# EAGLE design vusbtinyisp_smt (EAGLE 6.5.0)
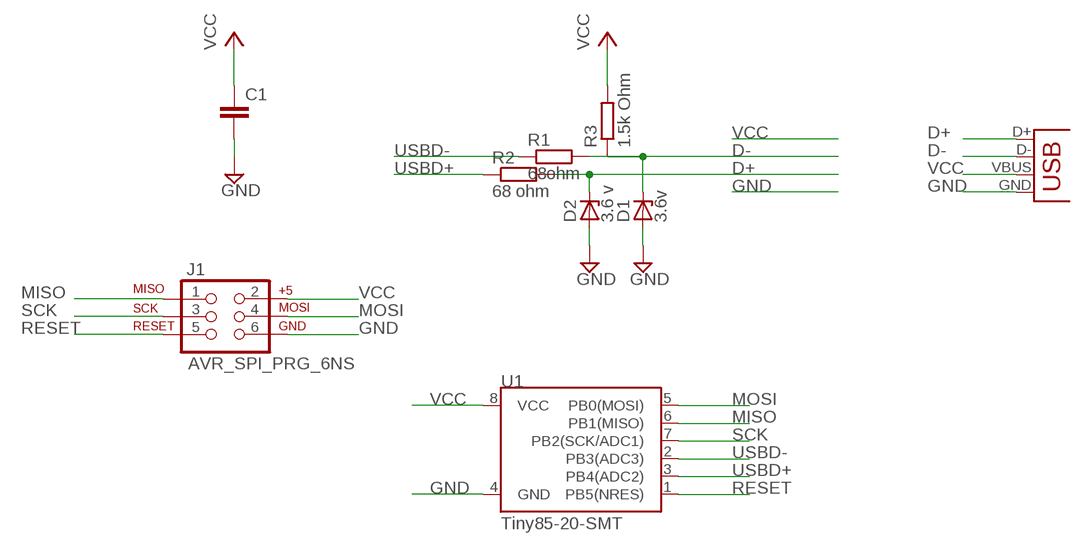
[diagram p0: schematic, sheet 1]

## Parts
C1  CAP1206  [1206]
D1  3.6v  ZENER-DIODESOT23  [SOT23]
D2  3.6 v  ZENER-DIODESOT23  [SOT23]
J1  AVR_SPI_PRG_6NS  [2X3-NS]
JP2  USBSMD  [USB-MINIB]
R1  68ohm  R-EU_R0805  [R0805]
R2  68 ohm  R-EU_R0805  [R0805]
R3  1.5k Ohm  R-EU_R1206  [R1206]
U1  Tiny85-20-SMT  ATTINY45TINY85-20-SMT  [SO08-EIAJ]

## Nets
D+: D2.3(C) JP2.D+ R2.2
D-: D1.3(C) JP2.D- R1.2 R3.1
GND: C1.2 D1.1(A) D2.1(A) J1.6 JP2.GND U1.4(GND)
MISO: J1.1 U1.6(PB1(MISO))
MOSI: J1.4 U1.5(PB0(MOSI))
RESET: J1.5 U1.1(PB5(NRES))
SCK: J1.3 U1.7(PB2(SCK/ADC1))
USBD+: R2.1 U1.3(PB4(ADC2))
USBD-: R1.1 U1.2(PB3(ADC3))
VCC: C1.1 J1.2 JP2.VBUS R3.2 U1.8(VCC)

## Library data of the parts
C1 = SparkFun-Passives:CAP: Capacitor Standard 0603 ceramic capacitor, and 0.1" leaded capacitor.
D1 D2 = diode:ZENER-DIODE: Z-Diode
J1 = SparkFun-Connectors:AVR_SPI_PRG_6: AVR ISP 6 Pin This is the reduced ISP connector for AVR programming. Common on Arduino. This footprint will take up less PCB space and can be used with a 10-pin to 6-pin adapter such as SKU: BOB-08508
JP2 = SparkFun-Connectors:USB: USB Connectors USB-B-PTH is fully proven SKU : PRT-00139/CONN-08278 USB-miniB is fully proven SKU : PRT-00587 USB-A-PCB is untested. USB-A-H is throughly reviewed, but untested. Spark Fun Electronics SKU : PRT-00437 USB-B-SMT is throughly reviewed, but untested. Needs silkscreen touching up. USB-A-S has not been used/tested USB-MB-H has not been used/tested USB-MICROB has been used. CONN-09505; PROD_ID: CONN-08193
R1-R3 = resistor:R-EU_: RESISTOR, European symbol
U1 = SparkFun-DigitalIC:ATTINY45: Atmel 8-pin 2/4/8kB flash uC; PROD_ID: IC-09092

## Net classes
0 default: width 0.203 mm, clearance 0.152 mm

## Board
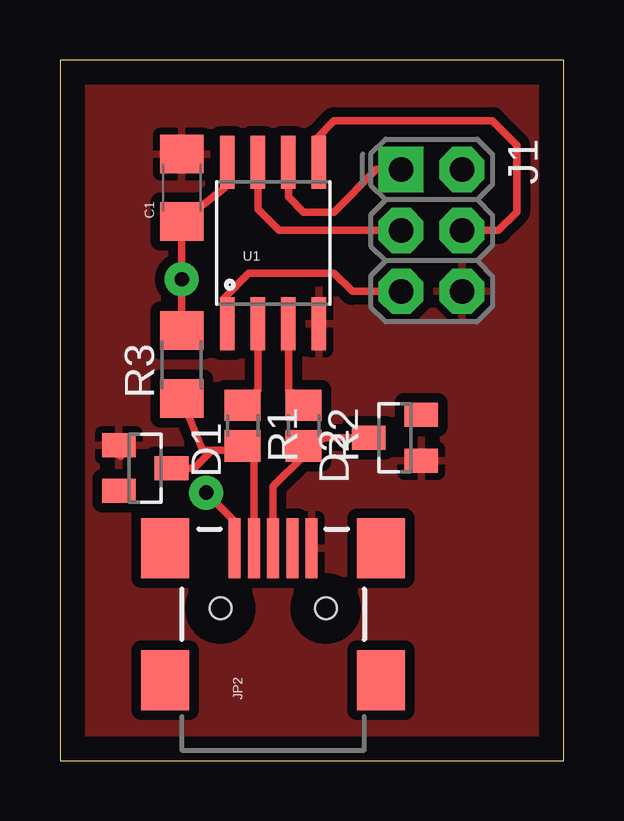
[diagram p1: board, top side]
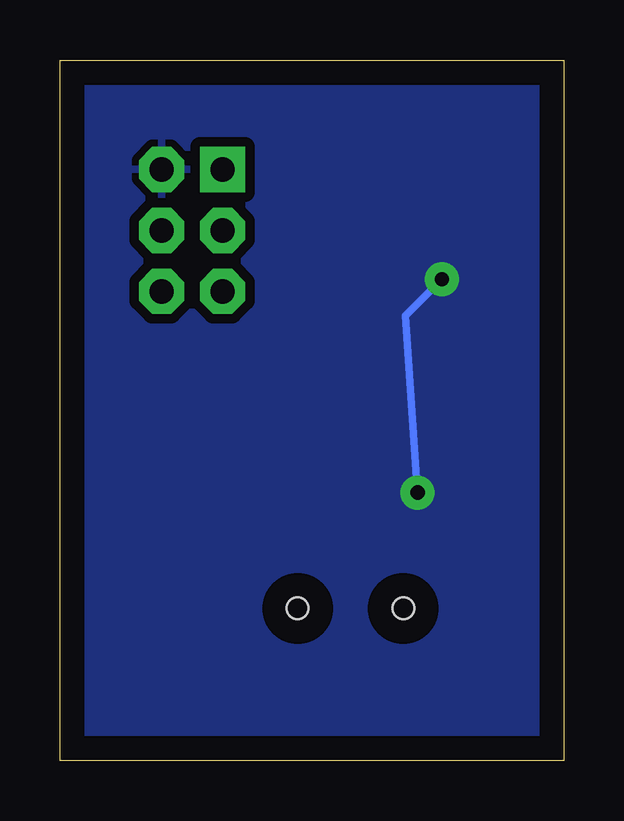
[diagram p2: board, bottom side, seen from below]

Size 21.01 x 29.2 mm. Coordinates in mm from the lower left corner, seen from the top.
Outline: 0,0 21.01,0 21.01,29.2 0,29.2 0,0
Copper layers (1*16): Top 0.035mm / dielectric 1.5mm / Bottom 0.035mm
Design rules "improved_12mil": minimum track width 12mil, minimum drill 0.8mm, track to track 12mil, track to pad 12mil, pad to pad 12mil, via to via 12mil, smd to smd 12mil, copper to edge 40mil, drill to drill 12mil, minimum pad ring 16mil, minimum via ring 16mil, stop-mask expansion 4mil, vias tented up to drill 0mil, thermal gap 12mil

### Footprints (pad centres in the part's own frame; a part is rotated, then mirrored left to right if it is on the bottom)
1206 = smd 1.6 x 1.8: 1 -1.4,0; 2 1.4,0
SOT23 = smd 1 x 1.4: 1 -0.95,-1.1; 2 0.95,-1.1; 3 0,1.1
2X3-NS = drill 1.016 pad 1.88 square: 1 -2.54,-1.27 | drill 1.016 pad 1.88 octagon: 2 -2.54,1.27; 3 0,-1.27; 4 0,1.27; 5 2.54,-1.27; 6 2.54,1.27
USB-MINIB = smd 2.5 x 0.5: D+ 2.5,0; D- 2.5,0.8; GND 2.5,-1.6; ID 2.5,-0.8; VBUS 2.5,1.6 | smd 2.5 x 2: MTN1 -3,4.5; MTN2 2.5,4.5; MTN3 -3,-4.5; MTN4 2.5,-4.5 | hole 0.9: 0,2.2; 0,-2.2
R0805 = smd 1.3 x 1.5: 1 -0.85,0; 2 0.85,0
R1206 = smd 1.6 x 1.803: 1 -1.422,0; 2 1.422,0
SO08-EIAJ = smd 0.61 x 2.21: 1 -1.905,-3.378; 2 -0.635,-3.378; 3 0.635,-3.378; 4 1.905,-3.378; 5 1.905,3.353; 6 0.635,3.353; 7 -0.635,3.353; 8 -1.905,3.353

### Placement (x,y rotation side)
C1  5.08,23.88 90 top
D1  3.56,12.19 270 top
D2  13.97,13.46 90 top
J1  15.49,22.1 270 top
JP2  8.89,6.35 90 top
R1  7.62,13.97 270 top
R2  10.16,13.97 270 top
R3  5.08,16.51 90 top
U1  8.89,21.59 0 top

### Tracks (layer width: path | path; a pad name or v marks a point on that pad's centre or on a via)
D+
  Top 0.305: JP2.D+ 8.89,11.43 10.16,12.7 R2.2 11.09,13.46 D2.3
D-
  Top 0.305: 7.45,12.95 R1.2 8.09,12.65 JP2.D- | 7.45,12.95 7.45,12.87 | 7.45,12.95 6.35,12.95 | 6.35,12.95 5.95,12.95 R3.1 | D1.3 5.59,12.19 6.35,12.95
GND
  Top 0.305: D1.1 2.54,12.7 2.81,13.04
  pour Top (isolate 0.406): -2.54,31.75 -2.54,-2.54 21.59,-2.54 21.59,33.02 -1.27,33.02
MISO
  Top 0.305: U1.6 9.52,23.5 10.16,22.86 11.43,22.86 13.21,24.64 J1.1
MOSI
  Top 0.305: J1.4 18.29,22.1 19.05,22.86 19.05,25.65 18.03,26.67 11.43,26.67 10.67,25.91 10.67,25.07 U1.5
RESET
  Top 0.305: J1.5 12.19,19.56 11.43,20.32 7.87,20.32 6.86,19.3 6.86,18.34 U1.1
SCK
  Top 0.305: J1.3 9.14,22.1 8.25,22.99 U1.7
USBD+
  Top 0.305: U1.3 9.52,15.46 R2.1
USBD-
  Top 0.305: U1.2 8.25,15.46 R1.1
VCC  (via drill 0.6)
  Top 0.305: R3.2 v5.08,20.07 C1.1 6.73,23.75 6.86,23.88 6.86,24.82 U1.8 | JP2.VBUS 7.29,9.98 v6.1,11.18
  Bottom 0.305: v6.1,11.18 6.6,18.54 v5.08,20.07
  pour Bottom (isolate 0.406): -2.54,31.75 -2.54,-2.54 21.59,-2.54 21.59,33.02 -1.27,33.02